# Altium schematic sheet Main.SchDoc
size A4; SheetNumber: 1; SheetTotal: 10
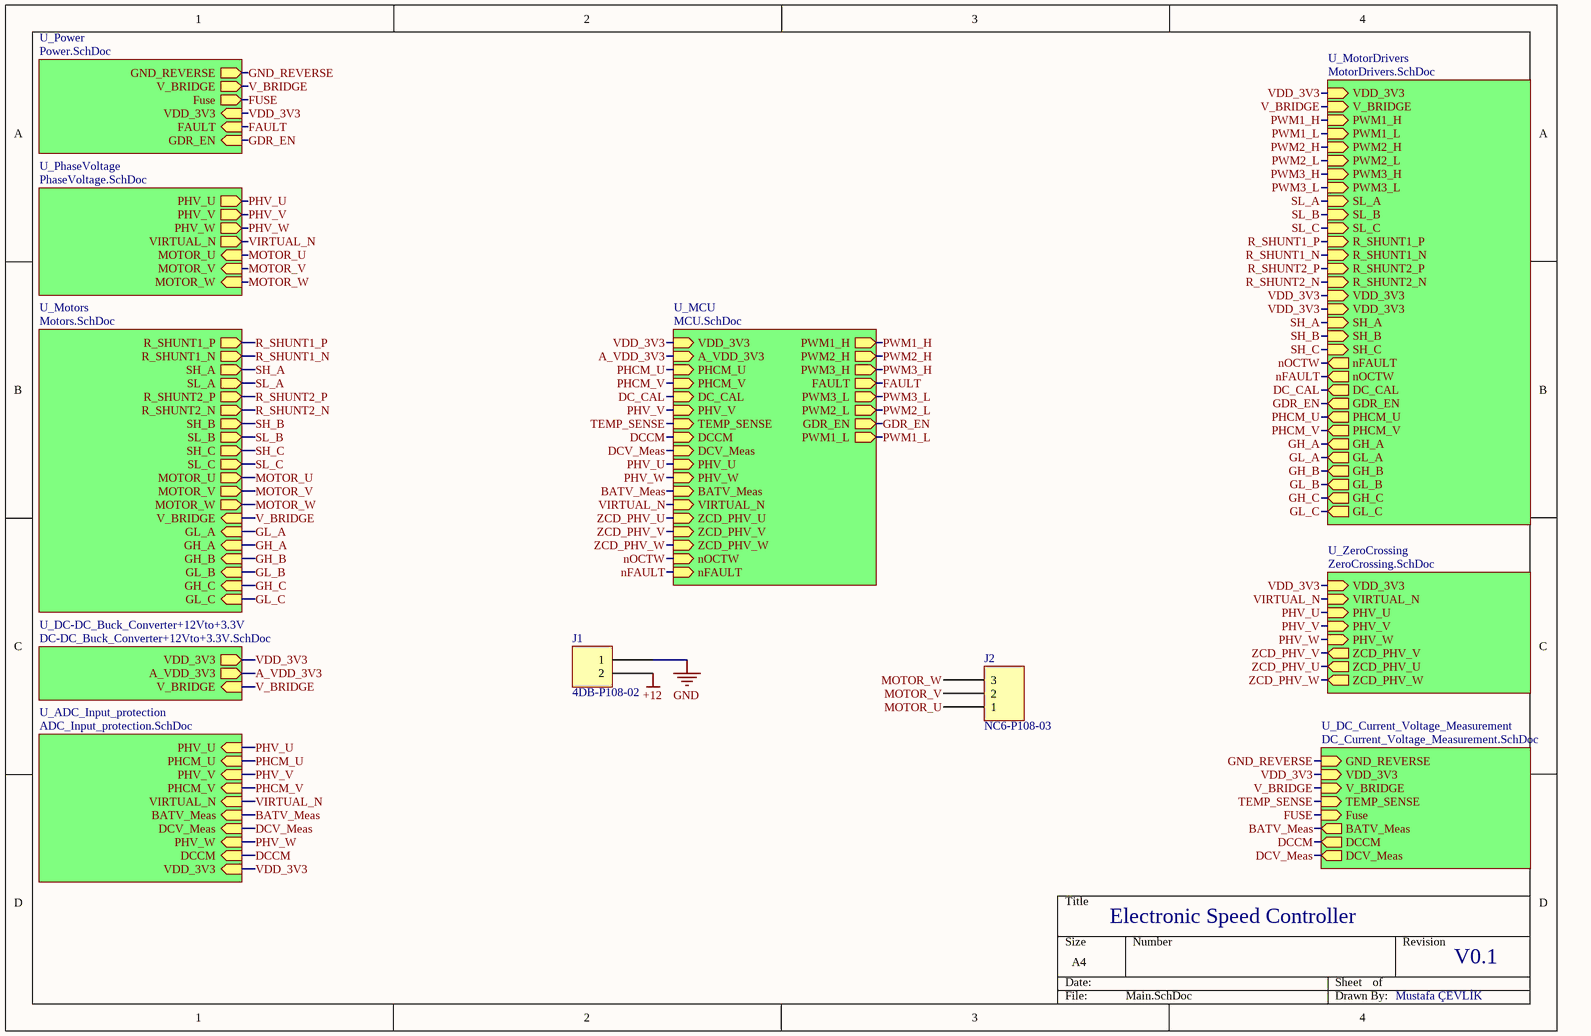
[diagram p0: Main.SchDoc]

## Parts
J1  4DB-P108-02  [TE 4DB-P108-02]
J2  NC6-P108-03  [TE NC6-P108-03]

## Sub-sheets
U_ADC_Input_protection = ADC_Input_protection.SchDoc: PHV_U (in), PHCM_U (in), PHV_V (in), PHCM_V (in), VIRTUAL_N (in), BATV_Meas (in), DCV_Meas (in), PHV_W (in), DCCM (in), VDD_3V3 (in)
U_DC-DC_Buck_Converter+12Vto+3.3V = DC-DC_Buck_Converter+12Vto+3.3V.SchDoc: V_BRIDGE (in), VDD_3V3 (out), A_VDD_3V3 (out)
U_DC_Current_Voltage_Measurement = DC_Current_Voltage_Measurement.SchDoc: DCCM (out), GND_REVERSE (in), VDD_3V3 (in), BATV_Meas (out), V_BRIDGE (in), DCV_Meas (out), TEMP_SENSE (in), Fuse (in)
U_MCU = MCU.SchDoc: VDD_3V3 (in), A_VDD_3V3 (in), PHCM_U (in), PHCM_V (in), DC_CAL (in), PHV_V (in), TEMP_SENSE (in), PWM1_H (out), PWM2_H (out), PWM3_H (out), DCCM (in), DCV_Meas (in), PHV_U (in), FAULT (out), PWM3_L (out), PHV_W (in), BATV_Meas (in), PWM2_L (out), VIRTUAL_N (in), ZCD_PHV_U (in), ZCD_PHV_V (in), ZCD_PHV_W (in), nOCTW (in), nFAULT (in), GDR_EN (out), PWM1_L (out)
U_MotorDrivers = MotorDrivers.SchDoc: VDD_3V3 (in), V_BRIDGE (in), nFAULT (out), nOCTW (out), DC_CAL (out), GDR_EN (out), PWM1_H (in), PWM1_L (in), PWM2_H (in), PWM2_L (in), PWM3_H (in), PWM3_L (in), PHCM_U (out), PHCM_V (out), GH_A (out), GL_A (out), SL_A (in), GH_B (out), GL_B (out), SL_B (in), GH_C (out), GL_C (out), SL_C (in), R_SHUNT1_P (in), R_SHUNT1_N (in), R_SHUNT2_P (in), R_SHUNT2_N (in), VDD_3V3 (in), VDD_3V3 (in), SH_A (in), SH_B (in), SH_C (in)
U_Motors = Motors.SchDoc: V_BRIDGE (in), R_SHUNT1_P (out), R_SHUNT1_N (out), GL_A (in), SH_A (out), SL_A (out), GH_A (in), R_SHUNT2_P (out), R_SHUNT2_N (out), SH_B (out), SL_B (out), GH_B (in), GL_B (in), SH_C (out), SL_C (out), GH_C (in), GL_C (in), MOTOR_U (out), MOTOR_V (out), MOTOR_W (out)
U_PhaseVoltage = PhaseVoltage.SchDoc: MOTOR_U (in), MOTOR_V (in), MOTOR_W (in), PHV_U (out), PHV_V (out), PHV_W (out), VIRTUAL_N (out)
U_Power = Power.SchDoc: GND_REVERSE (out), V_BRIDGE (out), VDD_3V3 (in), FAULT (in), GDR_EN (in), Fuse (out)
U_ZeroCrossing = ZeroCrossing.SchDoc: VDD_3V3 (in), VIRTUAL_N (in), ZCD_PHV_U (out), PHV_U (in), ZCD_PHV_V (out), PHV_V (in), ZCD_PHV_W (out), PHV_W (in)

## Nets
+12: J1.2
GND: J1.1
A_VDD_3V3: sheet U_DC-DC_Buck_Converter+12Vto+3.3V/A_VDD_3V3, sheet U_MCU/A_VDD_3V3
BATV_Meas: sheet U_ADC_Input_protection/BATV_Meas, sheet U_DC_Current_Voltage_Measurement/BATV_Meas, sheet U_MCU/BATV_Meas
DC_CAL: sheet U_MotorDrivers/DC_CAL, sheet U_MCU/DC_CAL
DCCM: sheet U_ADC_Input_protection/DCCM, sheet U_DC_Current_Voltage_Measurement/DCCM, sheet U_MCU/DCCM
DCV_Meas: sheet U_ADC_Input_protection/DCV_Meas, sheet U_DC_Current_Voltage_Measurement/DCV_Meas, sheet U_MCU/DCV_Meas
FAULT: sheet U_Power/FAULT, sheet U_MCU/FAULT
FUSE: sheet U_Power/Fuse, sheet U_DC_Current_Voltage_Measurement/Fuse
GDR_EN: sheet U_Power/GDR_EN, sheet U_MotorDrivers/GDR_EN, sheet U_MCU/GDR_EN
GH_A: sheet U_Motors/GH_A, sheet U_MotorDrivers/GH_A
GH_B: sheet U_Motors/GH_B, sheet U_MotorDrivers/GH_B
GH_C: sheet U_Motors/GH_C, sheet U_MotorDrivers/GH_C
GL_A: sheet U_Motors/GL_A, sheet U_MotorDrivers/GL_A
GL_B: sheet U_Motors/GL_B, sheet U_MotorDrivers/GL_B
GL_C: sheet U_Motors/GL_C, sheet U_MotorDrivers/GL_C
GND_REVERSE: sheet U_Power/GND_REVERSE, sheet U_DC_Current_Voltage_Measurement/GND_REVERSE
MOTOR_U: J2.1 ; sheet U_PhaseVoltage/MOTOR_U, sheet U_Motors/MOTOR_U
MOTOR_V: J2.2 ; sheet U_PhaseVoltage/MOTOR_V, sheet U_Motors/MOTOR_V
MOTOR_W: J2.3 ; sheet U_PhaseVoltage/MOTOR_W, sheet U_Motors/MOTOR_W
nFAULT: sheet U_MotorDrivers/nOCTW, sheet U_MCU/nFAULT
nOCTW: sheet U_MotorDrivers/nFAULT, sheet U_MCU/nOCTW
PHCM_U: sheet U_ADC_Input_protection/PHCM_U, sheet U_MotorDrivers/PHCM_U, sheet U_MCU/PHCM_U
PHCM_V: sheet U_ADC_Input_protection/PHCM_V, sheet U_MotorDrivers/PHCM_V, sheet U_MCU/PHCM_V
PHV_U: sheet U_PhaseVoltage/PHV_U, sheet U_ADC_Input_protection/PHV_U, sheet U_ZeroCrossing/PHV_U, sheet U_MCU/PHV_U
PHV_V: sheet U_PhaseVoltage/PHV_V, sheet U_ADC_Input_protection/PHV_V, sheet U_ZeroCrossing/PHV_V, sheet U_MCU/PHV_V
PHV_W: sheet U_PhaseVoltage/PHV_W, sheet U_ADC_Input_protection/PHV_W, sheet U_ZeroCrossing/PHV_W, sheet U_MCU/PHV_W
PWM1_H: sheet U_MotorDrivers/PWM1_H, sheet U_MCU/PWM1_H
PWM1_L: sheet U_MotorDrivers/PWM1_L, sheet U_MCU/PWM1_L
PWM2_H: sheet U_MotorDrivers/PWM2_H, sheet U_MCU/PWM2_H
PWM2_L: sheet U_MotorDrivers/PWM2_L, sheet U_MCU/PWM2_L
PWM3_H: sheet U_MotorDrivers/PWM3_H, sheet U_MCU/PWM3_H
PWM3_L: sheet U_MotorDrivers/PWM3_L, sheet U_MCU/PWM3_L
R_SHUNT1_N: sheet U_Motors/R_SHUNT1_N, sheet U_MotorDrivers/R_SHUNT1_N
R_SHUNT1_P: sheet U_Motors/R_SHUNT1_P, sheet U_MotorDrivers/R_SHUNT1_P
R_SHUNT2_N: sheet U_Motors/R_SHUNT2_N, sheet U_MotorDrivers/R_SHUNT2_N
R_SHUNT2_P: sheet U_Motors/R_SHUNT2_P, sheet U_MotorDrivers/R_SHUNT2_P
SH_A: sheet U_Motors/SH_A, sheet U_MotorDrivers/SH_A
SH_B: sheet U_Motors/SH_B, sheet U_MotorDrivers/SH_B
SH_C: sheet U_Motors/SH_C, sheet U_MotorDrivers/SH_C
SL_A: sheet U_Motors/SL_A, sheet U_MotorDrivers/SL_A
SL_B: sheet U_Motors/SL_B, sheet U_MotorDrivers/SL_B
SL_C: sheet U_Motors/SL_C, sheet U_MotorDrivers/SL_C
TEMP_SENSE: sheet U_DC_Current_Voltage_Measurement/TEMP_SENSE, sheet U_MCU/TEMP_SENSE
V_BRIDGE: sheet U_Power/V_BRIDGE, sheet U_Motors/V_BRIDGE, sheet U_DC-DC_Buck_Converter+12Vto+3.3V/V_BRIDGE, sheet U_MotorDrivers/V_BRIDGE, sheet U_DC_Current_Voltage_Measurement/V_BRIDGE
VDD_3V3: sheet U_Power/VDD_3V3, sheet U_DC-DC_Buck_Converter+12Vto+3.3V/VDD_3V3, sheet U_ADC_Input_protection/VDD_3V3, sheet U_MotorDrivers/VDD_3V3, sheet U_MotorDrivers/VDD_3V3, sheet U_MotorDrivers/VDD_3V3, sheet U_ZeroCrossing/VDD_3V3, sheet U_DC_Current_Voltage_Measurement/VDD_3V3, sheet U_MCU/VDD_3V3
VIRTUAL_N: sheet U_PhaseVoltage/VIRTUAL_N, sheet U_ADC_Input_protection/VIRTUAL_N, sheet U_ZeroCrossing/VIRTUAL_N, sheet U_MCU/VIRTUAL_N
ZCD_PHV_U: sheet U_ZeroCrossing/ZCD_PHV_U, sheet U_MCU/ZCD_PHV_U
ZCD_PHV_V: sheet U_ZeroCrossing/ZCD_PHV_V, sheet U_MCU/ZCD_PHV_V
ZCD_PHV_W: sheet U_ZeroCrossing/ZCD_PHV_W, sheet U_MCU/ZCD_PHV_W

## Notes on the sheet
- Electronic Speed Controller
- V0.1
- Mustafa ÇEVLİK

## Library data of the parts
J1 = 4DB-P108-02: CONN BARRIER STRIP 2CIRC 0.325"; Manufacturer: TE Connectivity AMP Connectors; Barrier Type: 2 Wall (Dual); Bottom Termination: PC Pin; Current Rating (Amps): 20A; Number of Circuits: 2; Pitch: 0.325" (8.26mm); Top Termination: Screws with Captive Plate; Voltage Rating: 150V; Wire Gauge: 12-22 AWG; Part Number: 4DB-P108-02; Color: Black; ComponentLink1Description: Datasheet; ComponentLink1URL: https://www.te.com/commerce/DocumentDelivery/DDEController?Action=srchrtrv&DocNm=2-1437667-4&DocType=Customer+Drawing&DocLang=English; ComponentLink2Description: DigiKey Link; ComponentLink2URL: http://digikey.com/product-detail/en/te-connectivity-amp-connectors/4DB-P108-02/A98472-ND/1277921; LastUpdated: 15.01.2020 04:14:08; Lifecycle Status: Active; Minimum Order: 1; Number of Rows: 1; Number of Wire Entries: 2; Packaging: Bulk; Part Status: Active; Price: 1.04; Series: 4DB, Buchanan; Supplier 1: DigiKey; Supplier Part Number 1: A98472-ND; Terminal Block Type: Barrier Block
J2 = NC6-P108-03: CONN BARRIER STRIP 3CIRC 0.375"; Manufacturer: TE Connectivity AMP Connectors; Barrier Type: 2 Wall (Dual); Bottom Termination: PC Pin; Current Rating (Amps): 20A; Number of Circuits: 3; Pitch: 0.375" (9.53mm); Top Termination: Screws with Captive Plate; Voltage Rating: 300V; Wire Gauge: 12-22 AWG; Part Number: NC6-P108-03; Color: Black; ComponentLink1Description: Datasheet; ComponentLink1URL: https://www.te.com/commerce/DocumentDelivery/DDEController?Action=srchrtrv&DocNm=3-1437664-0&DocType=Customer+Drawing&DocLang=English; ComponentLink2Description: DigiKey Link; ComponentLink2URL: http://digikey.com/product-detail/en/te-connectivity-amp-connectors/NC6-P108-03/A98496-ND/1277927; LastUpdated: 15.01.2020 04:12:05; Lifecycle Status: Active; Minimum Order: 1; Number of Rows: 1; Number of Wire Entries: 3; Packaging: Bulk; Part Status: Active; Price: 2.16; Series: NC6, Buchanan; Supplier 1: DigiKey; Supplier Part Number 1: A98496-ND; Terminal Block Type: Barrier Block